# Altium schematic sheet MainSheet.SchDoc: Contact
size A4; Organization: SMO bvba; Address1: Nieuwendorpe 14; Address2: 9900 Eeklo; Address3: Belgie; DocumentNumber: 1; SheetNumber: 1; SheetTotal: 1
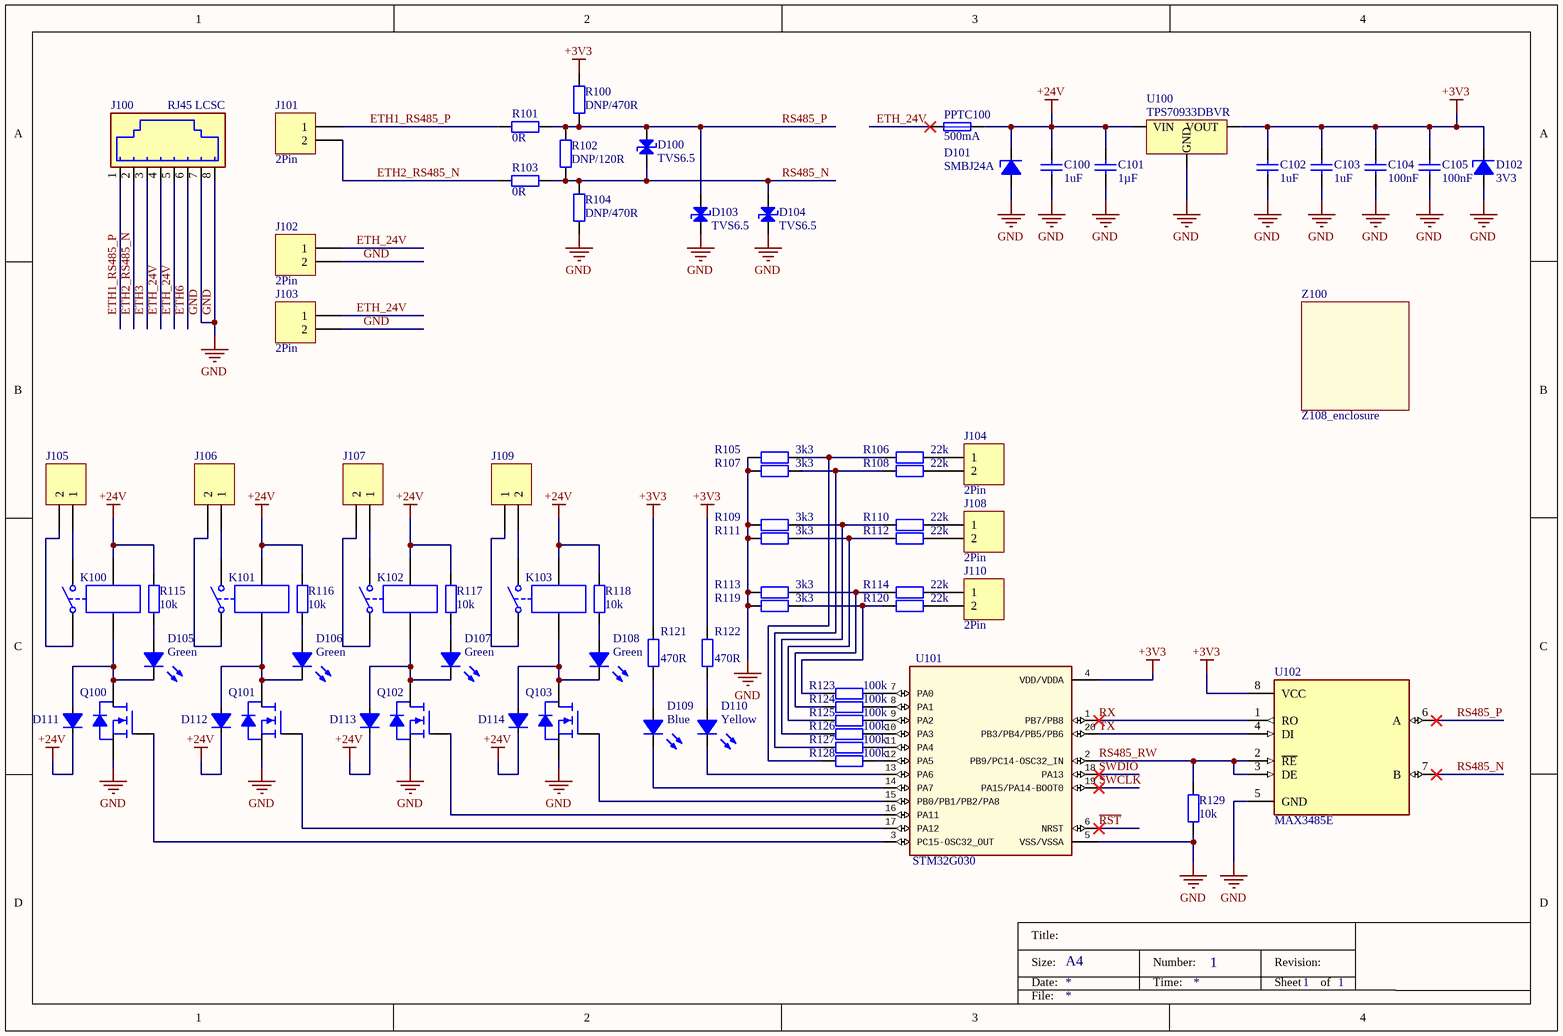
[diagram p0: MainSheet.SchDoc]

## Parts
C100  1uF  [C0603]
C101  1µF  [C0603]
C102  1uF  [C0603]
C103  1uF  [C0603]
C104  100nF  [C0603]
C105  100nF  [C0603]
D100  TVS6.5  [SOD323]
D101  SMBJ24A  [SMB]
D102  3V3  [SOD323]
D103  TVS6.5  [SOD323]
D104  TVS6.5  [SOD323]
D105  Green  [LED_0603_G]
D106  Green  [LED_0603_G]
D107  Green  [LED_0603_G]
D108  Green  [LED_0603_G]
D109  Blue  [LED_0603_B]
D110  Yellow  [LED_0603_G]
D111  Diode  [SOD323]  (value not drawn)
D112  Diode  [SOD323]  (value not drawn)
D113  Diode  [SOD323]  (value not drawn)
D114  Diode  [SOD323]  (value not drawn)
J100  RJ45 LCSC  [RJ45_RA]
J101  2Pin  [WURTH_691216710002]
J102  2Pin  [WURTH_691216710002]
J103  2Pin  [WURTH_691216710002]
J104  2Pin  [WURTH_691216710002]
J105  2Pin  [WURTH_691216910002]  (value not drawn)
J106  2Pin  [WURTH_691216910002]  (value not drawn)
J107  2Pin  [WURTH_691216910002]  (value not drawn)
J108  2Pin  [WURTH_691216710002]
J109  2Pin  [WURTH_691216910002]  (value not drawn)
J110  2Pin  [WURTH_691216710002]
K100  Relay-SPST  [G5RL-1A-E-HR]  (value not drawn)
K101  Relay-SPST  [G5RL-1A-E-HR]  (value not drawn)
K102  Relay-SPST  [G5RL-1A-E-HR]  (value not drawn)
K103  Relay-SPST  [G5RL-1A-E-HR]  (value not drawn)
PPTC100  500mA  [PPTC1812]
Q100  N-FET  [SOT323]  (value not drawn)
Q101  N-FET  [SOT323]  (value not drawn)
Q102  N-FET  [SOT323]  (value not drawn)
Q103  N-FET  [SOT323]  (value not drawn)
R100  DNP/470R  [R0603]
R101  0R  [R0603]
R102  DNP/120R  [R0603]
R103  0R  [R0603]
R104  DNP/470R  [R0603]
R105  3k3  [R0603]
R106  22k  [R0603]
R107  3k3  [R0603]
R108  22k  [R0603]
R109  3k3  [R0603]
R110  22k  [R0603]
R111  3k3  [R0603]
R112  22k  [R0603]
R113  3k3  [R0603]
R114  22k  [R0603]
R115  10k  [R0402]
R116  10k  [R0402]
R117  10k  [R0402]
R118  10k  [R0402]
R119  3k3  [R0603]
R120  22k  [R0603]
R121  470R  [R0603]
R122  470R  [R0603]
R123  100k  [R0603]
R124  100k  [R0603]
R125  100k  [R0603]
R126  100k  [R0603]
R127  100k  [R0603]
R128  100k  [R0603]
R129  10k  [R0603]
U100  TPS70933DBVR  [SOT-23-5]
U101  STM32G030  [TSSOP20]
U102  MAX3485E  [SOIC-08_DOMO]
Z100  Z108_enclosure  [Z108]

## Nets
+3V3: C102.2 C103.2 C104.2 C105.2 D102.1 R100.2 R121.2 R122.2 U100.5(VOUT) U101.4(VDD/VDDA) U102.8(VCC)
+24V: C100.2 C101.2 D101.1 D111.1 D112.1 D113.1 D114.1 K100.2 K101.2 K102.2 K103.2 PPTC100.2 R115.2 R116.2 R117.2 R118.2 U100.1(VIN)
GND: C100.1 C101.1 C102.1 C103.1 C104.1 C105.1 D101.2 D102.2 D103.1 D104.1 J100.7 J100.8 J102.2 J103.2 Q100.2(S) Q101.2(S) Q102.2(S) Q103.2(S) R104.1 R105.1 R107.1 R109.1 R111.1 R113.1 R119.1 R129.1 U100.2(GND) U101.5(VSS/VSSA) U102.5(GND)
~{RST}: U101.6(NRST)
ETH1_RS485_P: J100.1 J101.1 R101.1
ETH2_RS485_N: J100.2 J101.2 R103.1
ETH3: J100.3
ETH6: J100.6
ETH_24V: J100.4 J100.5 J102.1 J103.1 PPTC100.1
RS485_N: D100.1 D104.2 R102.1 R103.2 R104.2 U102.7(B)
RS485_P: D100.2 D103.2 R100.1 R101.2 R102.2 U102.6(A)
RS485_RW: R129.2 U101.2(PB9/PC14-OSC32_IN) U102.2(~{RE}) U102.3(DE)
RX: U101.1(PB7/PB8) U102.1(RO)
SWCLK: U101.19(PA15/PA14-BOOT0)
SWDIO: U101.18(PA13)
TX: U101.20(PB3/PB4/PB5/PB6) U102.4(DI)
NetD105_1: D105.1 R115.1
NetD105_2: D105.2 D111.2 K100.1 Q100.3(D)
NetD106_1: D106.1 R116.1
NetD106_2: D106.2 D112.2 K101.1 Q101.3(D)
NetD107_1: D107.1 R117.1
NetD107_2: D107.2 D113.2 K102.1 Q102.3(D)
NetD108_1: D108.1 R118.1
NetD108_2: D108.2 D114.2 K103.1 Q103.3(D)
NetD109_1: D109.1 R121.1
NetD109_2: D109.2 U101.14(PA7)
NetD110_1: D110.1 R122.1
NetD110_2: D110.2 U101.13(PA6)
NetJ104_1: J104.1 R106.2
NetJ104_2: J104.2 R108.2
NetJ105_1: J105.1 K100.3
NetJ105_2: J105.2 K100.4
NetJ106_1: J106.1 K101.3
NetJ106_2: J106.2 K101.4
NetJ107_1: J107.1 K102.3
NetJ107_2: J107.2 K102.4
NetJ108_1: J108.1 R110.2
NetJ108_2: J108.2 R112.2
NetJ109_1: J109.1 K103.4
NetJ109_2: J109.2 K103.3
NetJ110_1: J110.1 R114.2
NetJ110_2: J110.2 R120.2
NetQ100_1: Q100.1(G) U101.3(PC15-OSC32_OUT)
NetQ101_1: Q101.1(G) U101.17(PA12)
NetQ102_1: Q102.1(G) U101.16(PA11)
NetQ103_1: Q103.1(G) U101.15(PB0/PB1/PB2/PA8)
NetR105_2: R105.2 R106.1 R128.1
NetR107_2: R107.2 R108.1 R127.1
NetR109_2: R109.2 R110.1 R126.1
NetR111_2: R111.2 R112.1 R125.1
NetR113_2: R113.2 R114.1 R124.1
NetR119_2: R119.2 R120.1 R123.1
NetR123_2: R123.2 U101.7(PA0)
NetR124_2: R124.2 U101.8(PA1)
NetR125_2: R125.2 U101.9(PA2)
NetR126_2: R126.2 U101.10(PA3)
NetR127_2: R127.2 U101.11(PA4)
NetR128_2: R128.2 U101.12(PA5)

## Notes on the sheet
- Title:
- Size:
- Date:
- A4
- Number:
- Time:
- Revision:
- Sheet
- of
- File:

## Library data of the parts
C100-C105 = Capacitor
D100 D103 D104 = TVS Bi
D101 D102 = TVS Uni
D105-D110 = Led
J100 = RJ45 LCSC: Jack Modular Connector 8p8c (RJ45, Ethernet) Vertical Unshielded Cat5; MF: Wurth Elektronik; MP: 615008144221; Price: None; Purchase-URL: https://pricing.snapeda.com/search/part/615008144221/?ref=eda; Value: *; Package: None; Availability: In Stock
K100-K103 = Relay-SPST: Single-Pole Single-Throw Relay; Published: 24-Mar-1999; LatestRevisionDate: 17-Jul-2002; LatestRevisionNote: Re-released for DXP Platform.; PackageReference: MODULE4; Publisher: Altium Limited
PPTC100 = PPTC: Polymeric PTC Resettable Fuse 24V 500mA Ih Surface Mount 1812 _4532 Metric_, Concave; MP: MINISMDC050F-2; MF: Littelfuse Inc.; SnapEDA_Link: https://www.snapeda.com/parts/MINISMDC050F-2/Littelfuse%20Inc./view-part/9620/?ref=snap; Package: 1812 TE Connectivity / Raychem; Digi-Key_Purchase_URL: https://www.digikey.com/product-detail/en/littelfuse-inc/MINISMDC050F-2/MINISMDC050F-2CT-ND/1045862?utm_source=snapeda&utm_medium=aggregator&utm_campaign=symbol; Digi-Key_Part_Number: MINISMDC050F-2CT-ND; Value: *
R100-R129 = Resistor
U100 = LDO: MP: LP38690DT-5.0/NOPB; MF: Texas Instruments; Availability: Warning; Package: TO-252-3 Texas Instruments; Value: *; Purchase-URL: https://pricing.snapeda.com/search/part/LP38690DT-5.0/NOPB/?ref=eda; SnapEDA_Link: https://www.snapeda.com/parts/LP38690DT-5.0/NOPB/Texas%20Instruments/view-part/25360/?ref=snap; Price: None
U101 = STM32G030: Mfr_Name: STMicroelectronics; GateName_1: A; SymbolName_1: STM32G030F6P6TR; DeviceName: TSSOP20-L; LibraryName: 2022-06-19_13-31-56_Library; DeviceSetName: STM32G030F6P6TR; Copyright: Copyright (C) 2022 Ultra Librarian. All rights reserved.; Manufacturer_Part_Number: STM32G030F6P6TR
U102 = MAX3485E: 1/1 Transceiver Half RS422, RS485 8-SOIC; MF: Maxim Integrated; MP: MAX3485EESA+T; Value: *; Package: SOIC-8 Maxim; Check_prices: https://www.snapeda.com/parts/MAX3485EESA+T/Maxim%20Integrated/view-part/574654/?ref=eda; SnapEDA_Link: https://www.snapeda.com/parts/MAX3485EESA+T/Maxim%20Integrated/view-part/574654/?ref=snap; Digi-Key_Part_Number: MAX3485EESA+TCT-ND